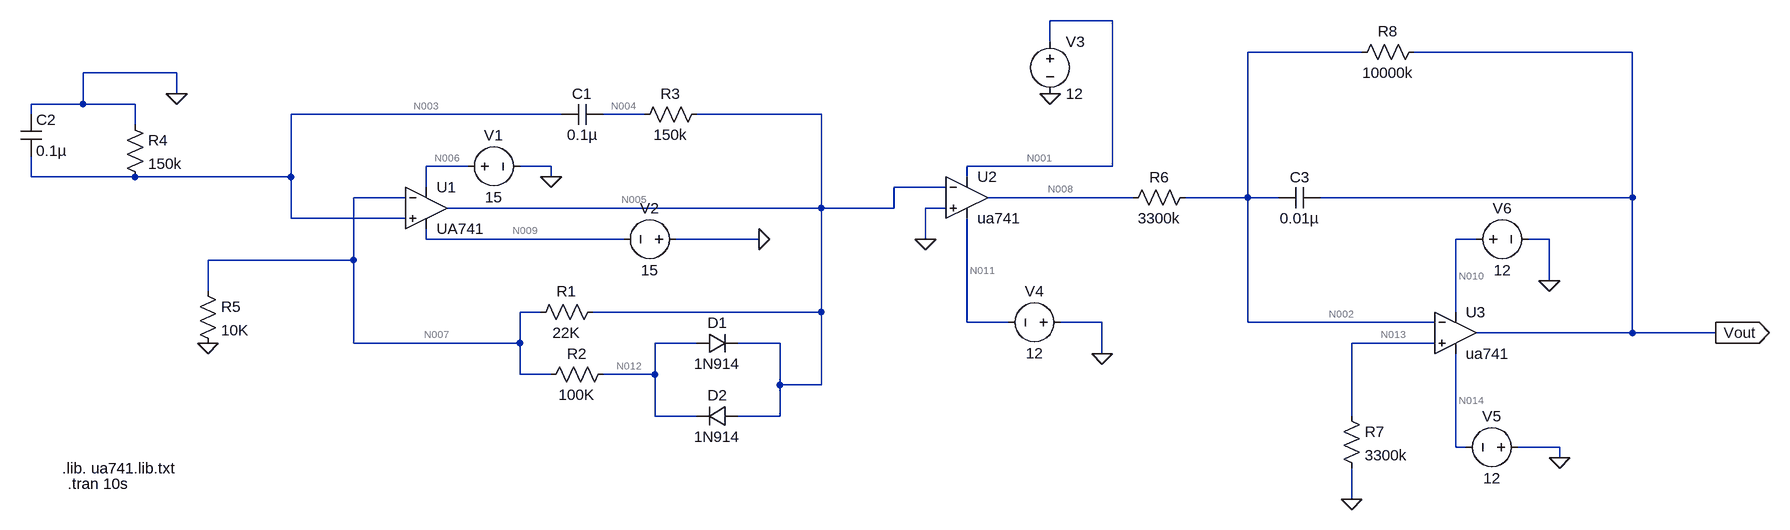
[diagram p0: schematic wien_bridgesine_to_square_to_triangular.asc]
wien_bridgesine_to_square_to_triangular.asc, the LTspice schematic file:
Version 4
SHEET 1 2336 868
WIRE 1296 -144 1200 -144
WIRE 1200 -112 1200 -144
WIRE 1680 -96 1504 -96
WIRE 2096 -96 1760 -96
WIRE -144 -64 -288 -64
WIRE -144 -32 -144 -64
WIRE -288 -16 -288 -64
WIRE -288 -16 -368 -16
WIRE -208 -16 -288 -16
WIRE -368 0 -368 -16
WIRE 448 0 32 0
WIRE 576 0 512 0
WIRE 848 0 656 0
WIRE -208 16 -208 -16
WIRE 304 80 240 80
WIRE 432 80 384 80
WIRE 1296 80 1296 -144
WIRE 1296 80 1072 80
WIRE -368 96 -368 64
WIRE -208 96 -368 96
WIRE 32 96 32 0
WIRE 32 96 -208 96
WIRE 432 96 432 80
WIRE 1072 96 1072 80
WIRE 240 112 240 80
WIRE 1040 112 960 112
WIRE 208 128 128 128
WIRE 1328 128 1104 128
WIRE 1504 128 1504 -96
WIRE 1504 128 1408 128
WIRE 1552 128 1504 128
WIRE 2096 128 2096 -96
WIRE 2096 128 1616 128
WIRE 848 144 848 0
WIRE 848 144 272 144
WIRE 960 144 960 112
WIRE 960 144 848 144
WIRE 1040 144 1008 144
WIRE 32 160 32 96
WIRE 208 160 32 160
WIRE 240 192 240 176
WIRE 544 192 240 192
WIRE 752 192 624 192
WIRE 1008 192 1008 144
WIRE 1856 192 1824 192
WIRE 1968 192 1936 192
WIRE 128 224 128 128
WIRE 128 224 -96 224
WIRE 1968 256 1968 192
WIRE -96 272 -96 224
WIRE 416 304 384 304
WIRE 848 304 848 144
WIRE 848 304 496 304
WIRE 1824 304 1824 192
WIRE 1072 320 1072 160
WIRE 1136 320 1072 320
WIRE 1280 320 1216 320
WIRE 1504 320 1504 128
WIRE 1792 320 1504 320
WIRE 2096 336 2096 128
WIRE 2096 336 1856 336
WIRE 2224 336 2096 336
WIRE 128 352 128 224
WIRE 384 352 384 304
WIRE 384 352 128 352
WIRE 656 352 592 352
WIRE 784 352 720 352
WIRE 1792 352 1664 352
WIRE 1280 368 1280 320
WIRE 384 400 384 352
WIRE 432 400 384 400
WIRE 592 400 592 352
WIRE 592 400 512 400
WIRE 784 416 784 352
WIRE 848 416 848 304
WIRE 848 416 784 416
WIRE 592 464 592 400
WIRE 656 464 592 464
WIRE 784 464 784 416
WIRE 784 464 720 464
WIRE 1664 464 1664 352
WIRE 1824 512 1824 368
WIRE 1840 512 1824 512
WIRE 1984 512 1920 512
WIRE 1984 528 1984 512
WIRE 1664 592 1664 544
FLAG -144 -32 0
FLAG -96 352 0
FLAG 432 96 0
FLAG 752 192 0
FLAG 1200 -32 0
FLAG 1280 368 0
FLAG 1008 192 0
FLAG 1968 256 0
FLAG 1984 528 0
FLAG 1664 592 0
FLAG 2224 336 Vout
IOPIN 2224 336 Out
SYMBOL OpAmps\\opamp2 240 80 R0
SYMATTR InstName U1
SYMATTR Value UA741
SYMBOL res 512 288 R90
WINDOW 0 0 56 VBottom 2
WINDOW 3 32 56 VTop 2
SYMATTR InstName R1
SYMATTR Value 22K
SYMBOL res 528 384 R90
WINDOW 0 0 56 VBottom 2
WINDOW 3 32 56 VTop 2
SYMATTR InstName R2
SYMATTR Value 100K
SYMBOL diode 656 368 R270
WINDOW 0 32 32 VTop 2
WINDOW 3 0 32 VBottom 2
SYMATTR InstName D1
SYMATTR Value 1N914
SYMBOL diode 720 448 R90
WINDOW 0 0 32 VBottom 2
WINDOW 3 32 32 VTop 2
SYMATTR InstName D2
SYMATTR Value 1N914
SYMBOL res 672 -16 R90
WINDOW 0 0 56 VBottom 2
WINDOW 3 32 56 VTop 2
SYMATTR InstName R3
SYMATTR Value 150k
SYMBOL cap 512 -16 R90
WINDOW 0 0 32 VBottom 2
WINDOW 3 32 32 VTop 2
SYMATTR InstName C1
SYMATTR Value 0.1µ
SYMBOL cap -384 0 R0
SYMATTR InstName C2
SYMATTR Value 0.1µ
SYMBOL res -224 0 R0
SYMATTR InstName R4
SYMATTR Value 150k
SYMBOL res -112 256 R0
SYMATTR InstName R5
SYMATTR Value 10K
SYMBOL voltage 288 80 R270
WINDOW 0 32 56 VTop 2
WINDOW 3 -32 56 VBottom 2
WINDOW 123 0 0 Left 0
WINDOW 39 0 0 Left 0
SYMATTR InstName V1
SYMATTR Value 15
SYMBOL voltage 640 192 R90
WINDOW 0 -32 56 VBottom 2
WINDOW 3 32 56 VTop 2
WINDOW 123 0 0 Left 0
WINDOW 39 0 0 Left 0
SYMATTR InstName V2
SYMATTR Value 15
SYMBOL voltage 1200 -128 R0
WINDOW 123 0 0 Left 0
WINDOW 39 0 0 Left 0
SYMATTR InstName V3
SYMATTR Value 12
SYMBOL OpAmps\\ua741 1072 64 R0
SYMATTR InstName U2
SYMBOL voltage 1232 320 R90
WINDOW 0 -32 56 VBottom 2
WINDOW 3 32 56 VTop 2
SYMATTR InstName V4
SYMATTR Value 12
SYMBOL res 1424 112 R90
WINDOW 0 0 56 VBottom 2
WINDOW 3 32 56 VTop 2
SYMATTR InstName R6
SYMATTR Value 3300k
SYMBOL OpAmps\\ua741 1824 272 R0
SYMATTR InstName U3
SYMBOL voltage 1936 512 R90
WINDOW 0 -32 56 VBottom 2
WINDOW 3 32 56 VTop 2
SYMATTR InstName V5
SYMATTR Value 12
SYMBOL voltage 1840 192 R270
WINDOW 0 32 56 VTop 2
WINDOW 3 -32 56 VBottom 2
SYMATTR InstName V6
SYMATTR Value 12
SYMBOL cap 1616 112 R90
WINDOW 0 0 32 VBottom 2
WINDOW 3 32 32 VTop 2
SYMATTR InstName C3
SYMATTR Value 0.01µ
SYMBOL res 1648 448 R0
SYMATTR InstName R7
SYMATTR Value 3300k
SYMBOL res 1776 -112 R90
WINDOW 0 0 56 VBottom 2
WINDOW 3 32 56 VTop 2
SYMATTR InstName R8
SYMATTR Value 10000k
TEXT -320 544 Left 2 !.lib. ua741.lib.txt
TEXT -312 568 Left 2 !.tran 10s

The netlist it stands for:
* wien_bridgesine_to_square_to_triangular.asc
XU1 N003 N007 N006 N009 N005 UA741  ; pins In+ In- V+ V- OUT
R1 N005 N007 22K
R2 N012 N007 100K
D1 N012 N005 1N914
D2 N005 N012 1N914
R3 N005 N004 150k
C1 N004 N003 0.1µ
C2 0 N003 0.1µ
R4 0 N003 150k
R5 N007 0 10K
V1 N006 0 15
V2 0 N009 15
V3 N001 0 12
XU2 0 N005 N001 N011 N008 ua741  ; pins In+ In- V+ V- OUT
V4 0 N011 12
R6 N002 N008 3300k
XU3 N013 N002 N010 N014 Vout ua741  ; pins In+ In- V+ V- OUT
V5 0 N014 12
V6 N010 0 12
C3 Vout N002 0.01µ
R7 N013 0 3300k
R8 Vout N002 10000k
.model D D
.lib standard.dio
.lib. ua741.lib.txt
.tran 10s
.backanno
.end

* Results of the author's LTspice run, read from the files saved beside the schematic
* Operating Point, zero values left out:
*   V(n005) = -36.38 mV
*   V(n009) = -15 V
*   V(n006) = 15 V
*   V(n007) = -11.94 mV
*   V(n003) = -11.96 mV
*   V(n012) = -12.22 mV
*   V(n004) = -36.38 mV
*   V(n001) = 12 V
*   V(n008) = 11.59 V
*   V(n011) = -12 V
*   V(n002) = 5.428 V
*   V(vout) = -11.61 V
*   V(n014) = -12 V
*   V(n010) = 12 V
*   V(n013) = 55.4 µV
*   I(D2) = -1.042 nA
*   I(D1) = 1.775 nA
*   I(R8) = -1.704 µA
*   I(R7) = 16.79 pA
*   I(R6) = -1.868 µA
*   I(R5) = -1.194 µA
*   I(R4) = 79.72 nA
*   I(R2) = -2.817 nA
*   I(R1) = -1.111 µA
*   I(V6) = -1.337 mA
*   I(V5) = -1.32 mA
*   I(V4) = -1.337 mA
*   I(V3) = -1.33 mA
*   I(V2) = -1.667 mA
*   I(V1) = -1.667 mA
*   Ix(u1:1) = 79.72 nA
*   Ix(u1:2) = 79.76 nA
*   Ix(u1:3) = 1.667 mA
*   Ix(u1:4) = -1.667 mA
*   Ix(u1:5) = 1.069 µA
*   Ix(u2:1) = 114.6 nA
*   Ix(u2:2) = 44.87 nA
*   Ix(u2:3) = 1.33 mA
*   Ix(u2:4) = -1.337 mA
*   Ix(u2:5) = -1.868 µA
*   Ix(u3:1) = -16.79 pA
*   Ix(u3:2) = 163.8 nA
*   Ix(u3:3) = 1.337 mA
*   Ix(u3:4) = -1.32 mA
*   Ix(u3:5) = 1.704 µA
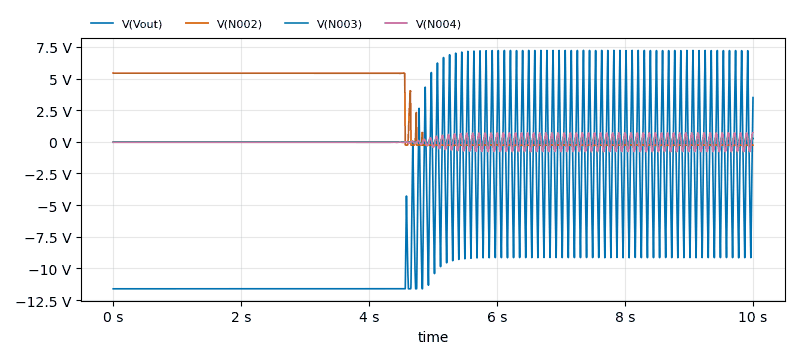
[diagram p1: Transient Analysis of wien_bridgesine_to_square_to_triangular.asc, plotted from the saved traces]
* Transient Analysis, 1 run:
*   V(Vout): min -11.61 V, max 7.23 V, average -6.08 V, rms 8.726 V, last 3.501 V
*   V(N002): min -263.6 mV, max 5.432 V, average 2.347 V, rms 3.674 V, last -263 mV
*   V(N003): min -355 mV, max 332.3 mV, average -11.5 mV, rms 169.2 mV, last 249.4 mV
*   V(N004): min -780 mV, max 725.7 mV, average -34.38 mV, rms 377.4 mV, last 725.7 mV